# Altium schematic sheet ESQUEMATICO BOMBA MESO.SchDoc
size A; SheetNumber: 1; SheetTotal: 2
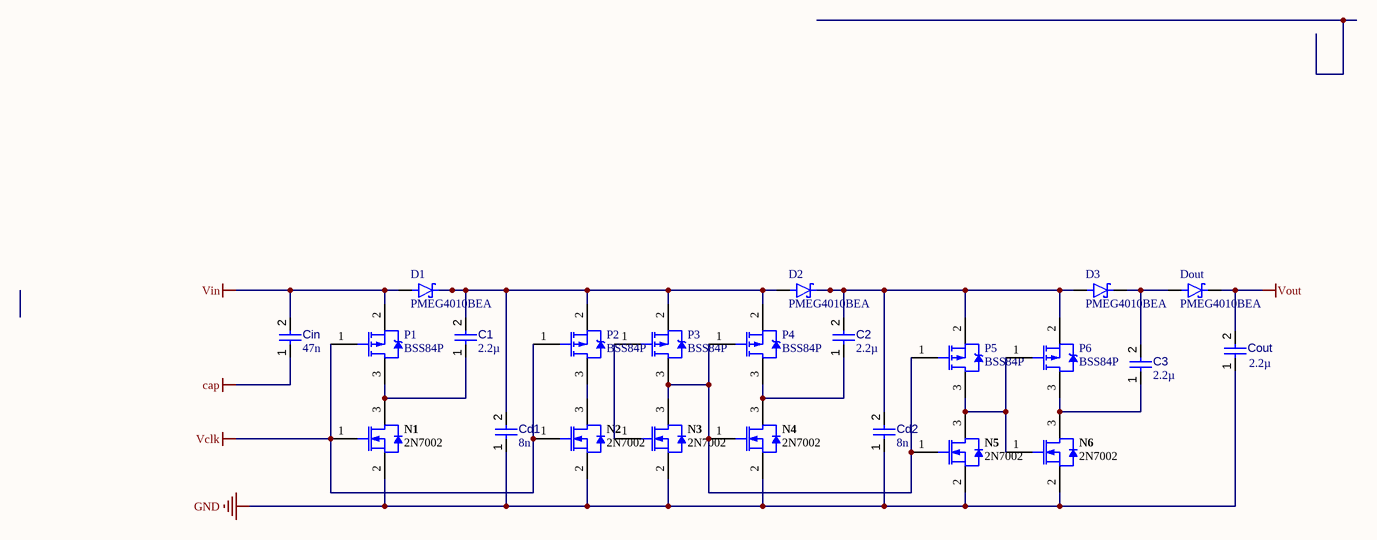
[diagram p0: ESQUEMATICO BOMBA MESO.SchDoc]

## Parts
C1  value 2.2µ  [CAPC2013X135X45NL10T25]  (hidden comment: Capacitor 10 uF +/- 10% 16 V 0805)
C2  value 2.2µ  [CAPC2013X135X45NL10T25]  (hidden comment: Capacitor 10 uF +/- 10% 16 V 0805)
C3  value 2.2µ  [CAPC2013X135X45NL10T25]  (hidden comment: Capacitor 10 uF +/- 10% 16 V 0805)
Cd1  value 8n  [CAPC2013X135X45NL10T25]  (hidden comment: Capacitor 10 uF +/- 10% 16 V 0805)
Cd2  value 8n  [CAPC2013X135X45NL10T25]  (hidden comment: Capacitor 10 uF +/- 10% 16 V 0805)
Cin  value 47n  [CAPC2013X135X45NL10T25]  (hidden comment: Capacitor 10 uF +/- 10% 16 V 0805)
Cout  value 2.2µ  [CAPC2013X135X45NL10T25]  (hidden comment: Capacitor 10 uF +/- 10% 16 V 0805)
D1  PMEG4010BEA  [DIO_BZX384-C30,115]
D2  PMEG4010BEA  [DIO_BZX384-C30,115]
D3  PMEG4010BEA  [DIO_BZX384-C30,115]
Dout  PMEG4010BEA  [DIO_BZX384-C30,115]
N1  2N7002  [INF-PG-SOT23_M]
N2  2N7002  [INF-PG-SOT23_M]
N3  2N7002  [INF-PG-SOT23_M]
N4  2N7002  [INF-PG-SOT23_M]
N5  2N7002  [INF-PG-SOT23_M]
N6  2N7002  [INF-PG-SOT23_M]
P1  BSS84P  [INF-PG-SOT23_N]
P2  BSS84P  [INF-PG-SOT23_N]
P3  BSS84P  [INF-PG-SOT23_N]
P4  BSS84P  [INF-PG-SOT23_N]
P5  BSS84P  [INF-PG-SOT23_N]
P6  BSS84P  [INF-PG-SOT23_N]

## Nets
cap: Cin.1
GND: Cd1.1 Cd2.1 Cout.1 N1.2(SOURCE) N2.2(SOURCE) N3.2(SOURCE) N4.2(SOURCE) N5.2(SOURCE) N6.2(SOURCE)
Vclk: N1.1(GATE) N2.1(GATE) P1.1(GATE) P2.1(GATE)
Vin: Cin.2 D1.A P1.2(SOURCE)
Vout: Cout.2 Dout.C(K)
NetC1_1: C1.1 N1.3(DRAIN) P1.3(DRAIN)
NetC1_2: C1.2 Cd1.2 D1.C(K) D2.A P2.2(SOURCE) P3.2(SOURCE) P4.2(SOURCE)
NetC2_1: C2.1 N4.3(DRAIN) P4.3(DRAIN)
NetC2_2: C2.2 Cd2.2 D2.C(K) D3.A P5.2(SOURCE) P6.2(SOURCE)
NetC3_1: C3.1 N6.3(DRAIN) P6.3(DRAIN)
NetC3_2: C3.2 D3.C(K) Dout.A
NetN2_3: N2.3(DRAIN) P2.3(DRAIN)
NetN3_1: N3.1(GATE) P3.1(GATE)
NetN3_3: N3.3(DRAIN) N4.1(GATE) N5.1(GATE) P3.3(DRAIN) P4.1(GATE) P5.1(GATE)
NetN5_3: N5.3(DRAIN) N6.1(GATE) P5.3(DRAIN) P6.1(GATE)

## Library data of the parts
C1-C3 Cd1 Cd2 Cin Cout = CMP-001-00015-6: Chip Capacitor, 10 uF, +/- 10%, 16 V, 0805 (2012 Metric); Voltage Rating: 16V; Capacitor Type: Ceramic; RoHS Compliant: True; Max Operating Temperature: 85°C; Min Operating Temperature: -55°C; Mounting Technology: SM; Tolerance: 10%; Case/Package: 0805; Pins: 2
D1-D3 Dout = SS54FSH: 5A, 40V, Schottky Rectifier; MF: Taiwan Semiconductor; Value: *; SnapEDA_Link: https://www.snapeda.com/parts/SS54FSH/Taiwan+Semiconductor/view-part/?ref=snap; MP: SS54FSH; Check_prices: https://www.snapeda.com/parts/SS54FSH/Taiwan+Semiconductor/view-part/?ref=eda; Availability: In Stock; Price: None; Package: SOD-128-2 Taiwan Semiconductor
N1-N6 = CMP-1149-00026-1: N-Channel OptiMOS Small-Signal-Transistor, 60 V VDS, 0.3 A ID, -55 to 150 degC, PG-SOT23, Reel, Green; Manufacturer: Infineon; RDS (on) (max) (@4.5V): 4,000 mOhm; VDS (max): 60 V; IDpuls (max): 1.2Â A; QG: 0.4Â nC; RDS (on) (max): 3,000 mOhm; RthJA (max): 250 K/W; ID (max): 0.3Â A; VGS(th) (max): 2.5Â V; VGS(th) (min): 1.5Â V; Green: TRUE; Ptot (max): 0.5Â W; PackageDescription: 3-Pin Small Outline Transistor Package, 2.9 x 1.3 mm Body, 0.95 mm Pitch; Halogen-free: TRUE; ComponentLink2Description: Datasheet; ComponentLink1URL: http://www.infineon.com/; Packing: Reel; DatasheetVersion: Rev. 2.4; PartNumber: 2N7002; PackageReference: PG-SOT23; PackageVersion: Apr-08; ComponentLink3URL: http://www.infineon.com/dgdl/SOT23-Package_Overview.pdf?folderId=db3a30431936bc4b0119532290053c66&fileId=db3a30431936bc4b0119533468123c85; ComponentLink1Description: Manufacturer URL; Mounting Technology: Surface Mount; ComponentLink3Description: Package Specification; ComponentLink2URL: http://www.infineon.com/dgdl/2N7002_Rev2.4.pdf?folderId=db3a3043156fd573011622e10b5c1f67&fileId=db3a304319bc939a0119c2a9461e79e6
P1-P6 = CMP-1099-00028-1: P-Channel SIPMOS Small-Signal-Transistor, -60 V VDS, -0.17 A ID, -55 to 150 degC, PG-SOT23, Reel, Green; Manufacturer: Infineon; VGS(th) (max): -2Â V; VGS(th) (min): -1Â V; VDS (max): -60Â V; Rth: 350Â K/W; Pto t (max): 0.36Â W; ID (max): -0.17Â A; IDpuls (max): -0.68Â A; RDS (on) (max) (@4.5V): 12,000Â mOhm; QG: 1Â nC; Green: TRUE; RDS (on) (max): 8,000Â mOhm; ComponentLink3URL: http://www.infineon.com/dgdl/SOT23-Package_Overview.pdf?folderId=db3a30431936bc4b0119532290053c66&fileId=db3a30431936bc4b0119533468123c85; ComponentLink3Description: Package Specification; Packing: Reel; PartNumber: BSS84P; ComponentLink2Description: Datasheet; Mounting Technology: Surface Mount; ComponentLink2URL: http://www.infineon.com/dgdl/BSS84P_Rev2.7%5B1%5D.pdf?folderId=db3a304314dca38901154a72e3951a65&fileId=db3a304330f68606013118ac7a9b4549; PackageReference: PG-SOT23; ComponentLink1URL: http://www.infineon.com/; PackageVersion: Apr-08; ComponentLink1Description: Manufacturer URL; PackageDescription: 3-Pin Small Outline Transistor Package, 2.9 x 1.3 mm Body, 0.95 mm Pitch; Halogen-free: TRUE; DatasheetVersion: Rev. 2.7